# Altium schematic sheet hapticDriverV3.SchDoc
size A2; Organization: Altium Limited; Address1: L3, 12a Rodborough Rd; Address2: Frenchs Forest; Address3: NSW; Address4: Australia 2086
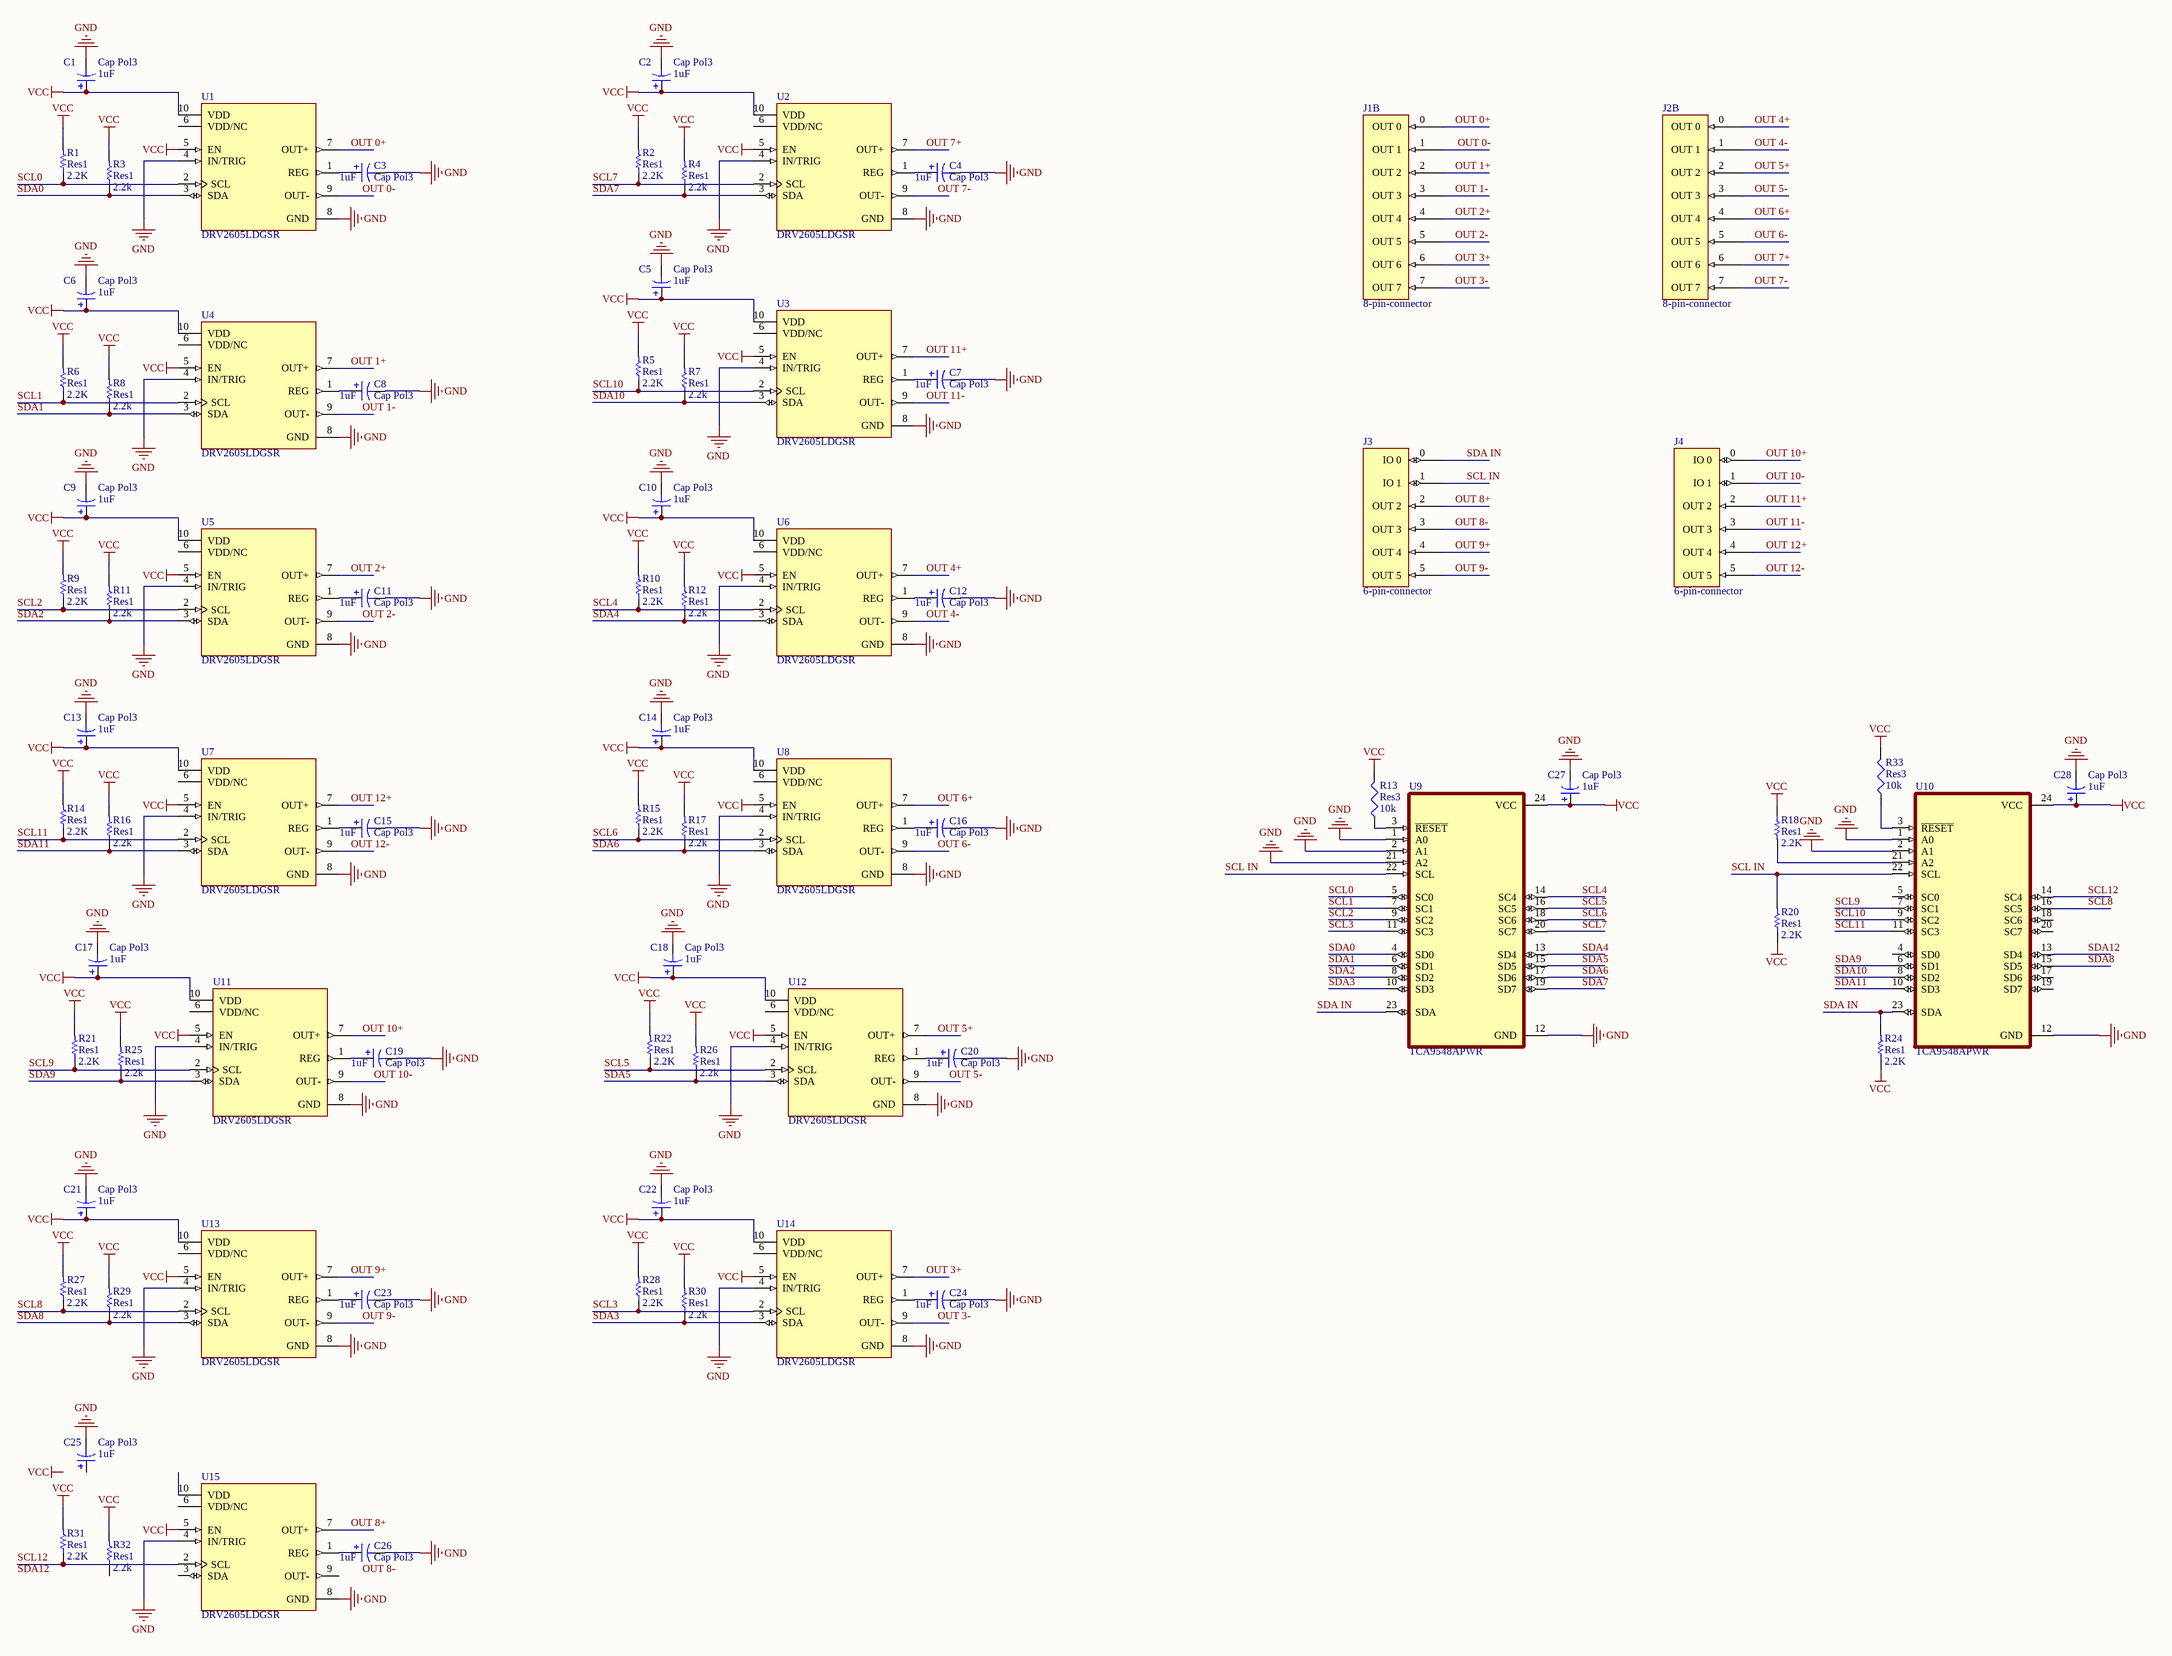
[diagram p0: hapticDriverV3.SchDoc]

## Parts
C1  Cap Pol3  value 1uF  [0402]
C2  Cap Pol3  value 1uF  [0402]
C3  Cap Pol3  value 1uF  [0402]
C4  Cap Pol3  value 1uF  [0402]
C5  Cap Pol3  value 1uF  [0402]
C6  Cap Pol3  value 1uF  [0402]
C7  Cap Pol3  value 1uF  [0402]
C8  Cap Pol3  value 1uF  [0402]
C9  Cap Pol3  value 1uF  [0402]
C10  Cap Pol3  value 1uF  [0402]
C11  Cap Pol3  value 1uF  [0402]
C12  Cap Pol3  value 1uF  [0402]
C13  Cap Pol3  value 1uF  [0402]
C14  Cap Pol3  value 1uF  [0402]
C15  Cap Pol3  value 1uF  [0402]
C16  Cap Pol3  value 1uF  [0402]
C17  Cap Pol3  value 1uF  [0402]
C18  Cap Pol3  value 1uF  [0402]
C19  Cap Pol3  value 1uF  [0402]
C20  Cap Pol3  value 1uF  [0402]
C21  Cap Pol3  value 1uF  [0402]
C22  Cap Pol3  value 1uF  [0402]
C23  Cap Pol3  value 1uF  [0402]
C24  Cap Pol3  value 1uF  [0402]
C25  Cap Pol3  value 1uF  [0402]
C26  Cap Pol3  value 1uF  [0402]
C27  Cap Pol3  value 1uF  [0402]
C28  Cap Pol3  value 1uF  [0402]
J1  8-pin-connector  [8-pin-connector]  (part B of 2)
J2  8-pin-connector  [8-pin-connector]  (part B of 2)
J3  6-pin-connector  [6-PIN-CONNECTOR]
J4  6-pin-connector  [6-PIN-CONNECTOR]
R1  Res1  value 2.2K  [0402]
R2  Res1  value 2.2K  [0402]
R3  Res1  value 2.2k  [0402]
R4  Res1  value 2.2k  [0402]
R5  Res1  value 2.2K  [0402]
R6  Res1  value 2.2K  [0402]
R7  Res1  value 2.2k  [0402]
R8  Res1  value 2.2k  [0402]
R9  Res1  value 2.2K  [0402]
R10  Res1  value 2.2K  [0402]
R11  Res1  value 2.2k  [0402]
R12  Res1  value 2.2k  [0402]
R13  Res3  value 10k  [0402]
R14  Res1  value 2.2K  [0402]
R15  Res1  value 2.2K  [0402]
R16  Res1  value 2.2k  [0402]
R17  Res1  value 2.2k  [0402]
R18  Res1  value 2.2K  [0402]
R20  Res1  value 2.2K  [0402]
R21  Res1  value 2.2K  [0402]
R22  Res1  value 2.2K  [0402]
R24  Res1  value 2.2K  [0402]
R25  Res1  value 2.2k  [0402]
R26  Res1  value 2.2k  [0402]
R27  Res1  value 2.2K  [0402]
R28  Res1  value 2.2K  [0402]
R29  Res1  value 2.2k  [0402]
R30  Res1  value 2.2k  [0402]
R31  Res1  value 2.2K  [0402]
R32  Res1  value 2.2k  [0402]
R33  Res3  value 10k  [0402]
U1  DRV2605LDGSR  [SOP50P490X110-10N]
U2  DRV2605LDGSR  [SOP50P490X110-10N]
U3  DRV2605LDGSR  [SOP50P490X110-10N]
U4  DRV2605LDGSR  [SOP50P490X110-10N]
U5  DRV2605LDGSR  [SOP50P490X110-10N]
U6  DRV2605LDGSR  [SOP50P490X110-10N]
U7  DRV2605LDGSR  [SOP50P490X110-10N]
U8  DRV2605LDGSR  [SOP50P490X110-10N]
U9  TCA9548APWR  [SOP65P640X120-24N]
U10  TCA9548APWR  [SOP65P640X120-24N]
U11  DRV2605LDGSR  [SOP50P490X110-10N]
U12  DRV2605LDGSR  [SOP50P490X110-10N]
U13  DRV2605LDGSR  [SOP50P490X110-10N]
U14  DRV2605LDGSR  [SOP50P490X110-10N]
U15  DRV2605LDGSR  [SOP50P490X110-10N]

## Nets
GND: C1.2 C2.2 C3.2 C4.2 C5.2 C6.2 C7.2 C8.2 C9.2 C10.2 C11.2 C12.2 C13.2 C14.2 C15.2 C16.2 C17.2 C18.2 C19.2 C20.2 C21.2 C22.2 C23.2 C24.2 C25.2 C26.2 C27.2 C28.2 U1.4(IN/TRIG) U1.8(GND) U2.4(IN/TRIG) U2.8(GND) U3.4(IN/TRIG) U3.8(GND) U4.4(IN/TRIG) U4.8(GND) U5.4(IN/TRIG) U5.8(GND) U6.4(IN/TRIG) U6.8(GND) U7.4(IN/TRIG) U7.8(GND) U8.4(IN/TRIG) U8.8(GND) U9.1(A0) U9.2(A1) U9.12(GND) U9.21(A2) U10.1(A0) U10.2(A1) U10.12(GND) U11.4(IN/TRIG) U11.8(GND) U12.4(IN/TRIG) U12.8(GND) U13.4(IN/TRIG) U13.8(GND) U14.4(IN/TRIG) U14.8(GND) U15.4(IN/TRIG) U15.8(GND)
VCC: C1.1 C2.1 C5.1 C6.1 C9.1 C10.1 C13.1 C14.1 C17.1 C18.1 C21.1 C22.1 C27.1 C28.1 R1.2 R2.2 R3.2 R4.2 R5.2 R6.2 R7.2 R8.2 R9.2 R10.2 R11.2 R12.2 R13.2 R14.2 R15.2 R16.2 R17.2 R18.1 R20.1 R21.2 R22.2 R24.1 R25.2 R26.2 R27.2 R28.2 R29.2 R30.2 R31.2 R32.2 R33.2 U1.5(EN) U1.10(VDD) U2.5(EN) U2.10(VDD) U3.5(EN) U3.10(VDD) U4.5(EN) U4.10(VDD) U5.5(EN) U5.10(VDD) U6.5(EN) U6.10(VDD) U7.5(EN) U7.10(VDD) U8.5(EN) U8.10(VDD) U9.24(VCC) U10.24(VCC) U11.5(EN) U11.10(VDD) U12.5(EN) U12.10(VDD) U13.5(EN) U13.10(VDD) U14.5(EN) U14.10(VDD) U15.5(EN)
\: J2.1(OUT_1) U6.9(OUT-)  [also labelled OUT 4-]
OUT 0+: J1.0(OUT_0) U1.7(OUT+)
OUT 0-: J1.1(OUT_1) U1.9(OUT-)
OUT 1+: J1.2(OUT_2) U4.7(OUT+)
OUT 1-: J1.3(OUT_3) U4.9(OUT-)
OUT 2+: J1.4(OUT_4) U5.7(OUT+)
OUT 2-: J1.5(OUT_5) U5.9(OUT-)
OUT 3+: J1.6(OUT_6) U14.7(OUT+)
OUT 3-: J1.7(OUT_7) U14.9(OUT-)
OUT 4+: J2.0(OUT_0) U6.7(OUT+)
OUT 5+: J2.2(OUT_2) U12.7(OUT+)
OUT 5-: J2.3(OUT_3) U12.9(OUT-)
OUT 6+: J2.4(OUT_4) U8.7(OUT+)
OUT 6-: J2.5(OUT_5) U8.9(OUT-)
OUT 7+: J2.6(OUT_6) U2.7(OUT+)
OUT 7-: J2.7(OUT_7) U2.9(OUT-)
OUT 8+: J3.2(OUT_2) U15.7(OUT+)
OUT 8-: J3.3(OUT_3)
OUT 9+: J3.4(OUT_4) U13.7(OUT+)
OUT 9-: J3.5(OUT_5) U13.9(OUT-)
OUT 10+: J4.0(IO_0) U11.7(OUT+)
OUT 10-: J4.1(IO_1) U11.9(OUT-)
OUT 11+: J4.2(OUT_2) U3.7(OUT+)
OUT 11-: J4.3(OUT_3) U3.9(OUT-)
OUT 12+: J4.4(OUT_4) U7.7(OUT+)
OUT 12-: J4.5(OUT_5) U7.9(OUT-)
SCL0: R1.1 U1.2(SCL) U9.5(SC0)
SCL1: R6.1 U4.2(SCL) U9.7(SC1)
SCL2: R9.1 U5.2(SCL) U9.9(SC2)
SCL3: R28.1 U9.11(SC3) U14.2(SCL)
SCL4: R10.1 U6.2(SCL) U9.14(SC4)
SCL5: R22.1 U9.16(SC5) U12.2(SCL)
SCL6: R15.1 U8.2(SCL) U9.18(SC6)
SCL7: R2.1 U2.2(SCL) U9.20(SC7)
SCL8: R27.1 U10.16(SC5) U13.2(SCL)
SCL9: R21.1 U10.7(SC1) U11.2(SCL)
SCL10: R5.1 U3.2(SCL) U10.9(SC2)
SCL11: R14.1 U7.2(SCL) U10.11(SC3)
SCL12: R31.1 U10.14(SC4) U15.2(SCL)
SCL IN: J3.1(IO_1) R20.2 U9.22(SCL) U10.22(SCL)
SDA0: R3.1 U1.3(SDA) U9.4(SD0)
SDA1: R8.1 U4.3(SDA) U9.6(SD1)
SDA2: R11.1 U5.3(SDA) U9.8(SD2)
SDA3: R30.1 U9.10(SD3) U14.3(SDA)
SDA4: R12.1 U6.3(SDA) U9.13(SD4)
SDA5: R26.1 U9.15(SD5) U12.3(SDA)
SDA6: R17.1 U8.3(SDA) U9.17(SD6)
SDA7: R4.1 U2.3(SDA) U9.19(SD7)
SDA8: R29.1 U10.15(SD5) U13.3(SDA)
SDA9: R25.1 U10.6(SD1) U11.3(SDA)
SDA10: R7.1 U3.3(SDA) U10.8(SD2)
SDA11: R16.1 U7.3(SDA) U10.10(SD3)
SDA12: U10.13(SD4)
SDA IN: J3.0(IO_0) R24.2 U9.23(SDA) U10.23(SDA)
NetC3_1: C3.1 U1.1(REG)
NetC4_1: C4.1 U2.1(REG)
NetC7_1: C7.1 U3.1(REG)
NetC8_1: C8.1 U4.1(REG)
NetC11_1: C11.1 U5.1(REG)
NetC12_1: C12.1 U6.1(REG)
NetC15_1: C15.1 U7.1(REG)
NetC16_1: C16.1 U8.1(REG)
NetC19_1: C19.1 U11.1(REG)
NetC20_1: C20.1 U12.1(REG)
NetC23_1: C23.1 U13.1(REG)
NetC24_1: C24.1 U14.1(REG)
NetC26_1: C26.1 U15.1(REG)
NetR13_1: R13.1 U9.3(~{RESET})
NetR18_2: R18.2 U10.21(A2)
NetR33_1: R33.1 U10.3(~{RESET})

Not connected (* = marked no-connect by the designer): C25 1; R32 1; U1 6(VDD/NC); U2 6(VDD/NC); U3 6(VDD/NC); U4 6(VDD/NC); U5 6(VDD/NC); U6 6(VDD/NC); U7 6(VDD/NC); U8 6(VDD/NC); U10 4(SD0) 5(SC0) 17(SD6) 18(SC6) 19(SD7) 20(SC7); U11 6(VDD/NC); U12 6(VDD/NC); U13 6(VDD/NC); U14 6(VDD/NC); U15 3(SDA) 6(VDD/NC) 9(OUT-) 10(VDD)

## Notes on the sheet
- Labels drawn without touching a wire or pin: OUT 8-, SDA12, VCC
- Title
- Size:
- Date:
- File:
- A2
- Number:
- Time:
- Revision:
- Sheet
- of

## Library data of the parts
C1-C28 = Cap Pol3: Polarized Capacitor (Surface Mount); Published: 8-Jun-2000; LatestRevisionDate: 29-May-2009; LatestRevisionNote: IPC-7351 Footprint Added.; PackageReference: C0805; Publisher: Altium Limited; PackageDescription: Chip Capacitor
R1-R12 R14-R18 R20-R22 R24-R32 = Res1: Resistor; Published: 8-Jun-2000; LatestRevisionDate: 17-Jul-2002; LatestRevisionNote: Re-released for DXP Platform.; PackageReference: AXIAL-0.3; Publisher: Altium Limited; PackageDescription: Axial Device, Thru-Hole; 2 Leads; 0.3 in Pin Spacing
R13 R33 = Res3: Resistor; Published: 8-Jun-2000; LatestRevisionDate: 29-May-2009; LatestRevisionNote: IPC-7351 Footprint Added.; PackageReference: J1-0603; Publisher: Altium Limited; PackageDescription: Chip Resistor
U1-U8 U11-U15 = DRV2605LDGSR: Haptic Driver for ERM and LRA with Built-In Library and Smart Loop Architecture 10-VSSOP -40 to 85; Price: None; MP: DRV2605LDGSR; Availability: Unavailable; Package: None; Value: *
U9 U10 = TCA9548APWR: Low-Voltage 8-Channel I2C Switch With Reset; MF: Texas Instruments; MP: TCA9548APWR; Price: None; DigiKey-Purchase-URL: https://snapeda.com/shop?store=DigiKey&id=280817; Package: TSSOP-24 Texas Instruments; Mouser-Purchase-URL: https://snapeda.com/shop?store=Mouser&id=280817; Texas_Instruments-Purchase-URL: https://snapeda.com/shop?store=Texas+Instruments&id=280817; Value: *; Availability: Unavailable; Arrow_Electronics-Purchase-URL: https://snapeda.com/shop?store=Arrow+Electronics&id=280817; SnapEDA_Link: https://www.snapeda.com/parts/TCA9548APWR/Texas%20Instruments/view-part/280817/?ref=snap